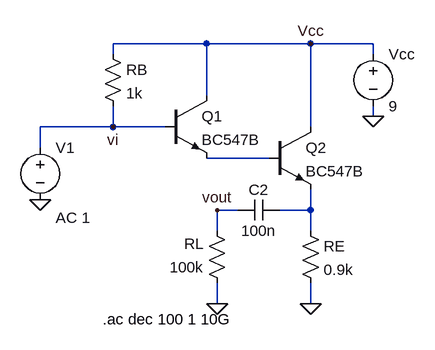
[diagram p0: schematic Zia.asc]
Zia.asc, the LTspice schematic file:
Version 4
SHEET 1 880 680
WIRE 176 32 32 32
WIRE 336 32 176 32
WIRE 432 32 336 32
WIRE 32 48 32 32
WIRE 432 48 432 32
WIRE 176 112 176 32
WIRE 432 144 432 128
WIRE 32 160 32 128
WIRE 32 160 -80 160
WIRE 112 160 32 160
WIRE 336 160 336 32
WIRE -80 192 -80 160
WIRE 272 208 176 208
WIRE 224 288 192 288
WIRE 336 288 336 256
WIRE 336 288 288 288
WIRE 192 320 192 288
WIRE 336 320 336 288
WIRE 192 432 192 400
WIRE 336 432 336 400
FLAG 432 144 0
FLAG 336 432 0
FLAG 336 32 Vcc
FLAG 192 432 0
FLAG 32 160 vi
FLAG 192 288 vout
FLAG -80 272 0
SYMBOL npn 112 112 R0
SYMATTR InstName Q1
SYMATTR Value BC547B
SYMBOL npn 272 160 R0
SYMATTR InstName Q2
SYMATTR Value BC547B
SYMBOL res 16 32 R0
SYMATTR InstName RB
SYMATTR Value 1k
SYMBOL voltage 432 32 R0
WINDOW 123 0 0 Left 0
WINDOW 39 0 0 Left 0
SYMATTR InstName Vcc
SYMATTR Value 9
SYMBOL res 320 304 R0
SYMATTR InstName RE
SYMATTR Value 0.9k
SYMBOL res 208 416 R180
WINDOW 0 36 76 Left 2
WINDOW 3 36 40 Left 2
SYMATTR InstName RL
SYMATTR Value 100k
SYMBOL cap 288 272 R90
WINDOW 0 0 32 VBottom 2
WINDOW 3 32 32 VTop 2
SYMATTR InstName C2
SYMATTR Value 100n
SYMBOL voltage -80 176 R0
WINDOW 123 24 124 Left 2
WINDOW 39 0 0 Left 0
SYMATTR InstName V1
SYMATTR Value ""
SYMATTR Value2 AC 1
TEXT 16 456 Left 2 !.ac dec 100 1 10G

The netlist it stands for:
* Zia.asc
Q1 Vcc vi N001 0 BC547B
Q2 Vcc N001 N002 0 BC547B
RB Vcc vi 1k
Vcc Vcc 0 9
RE N002 0 0.9k
RL 0 vout 100k
C2 N002 vout 100n
V1 vi 0 AC 1
.model NPN NPN
.model PNP PNP
.lib standard.bjt
.ac dec 100 1 10G
.backanno
.end